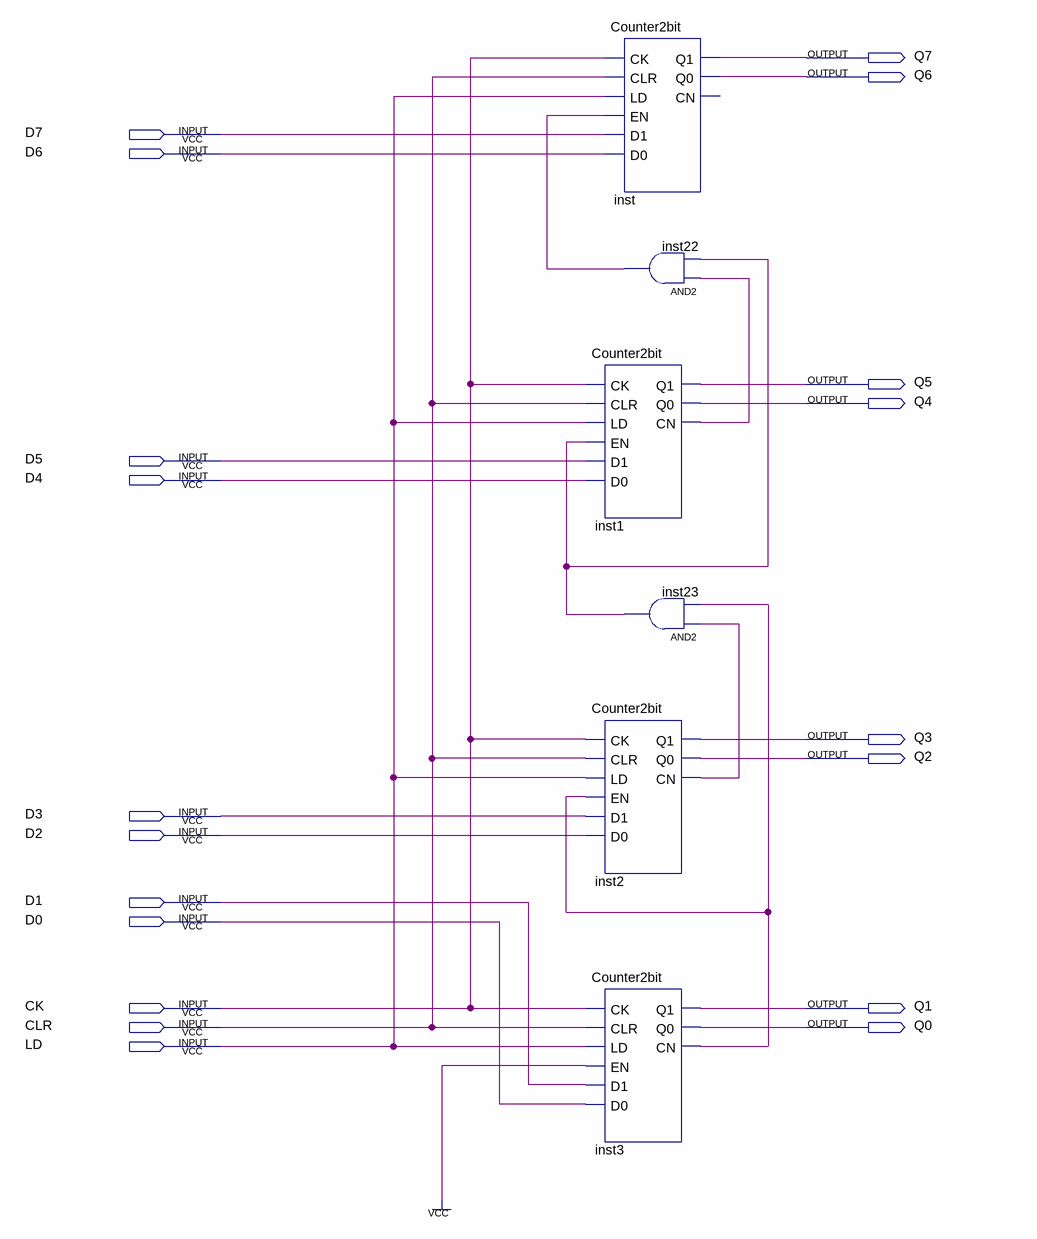
[diagram p0: schematic sheet]
// Quartus schematic Counter8bit.bdf as structural Verilog: 6 symbols, 19 pins
module Counter8bit (
  input  D7,
  input  D6,
  input  D5,
  input  D4,
  input  D3,
  input  D2,
  input  D1,
  input  D0,
  input  CK,
  input  CLR,
  input  LD,
  output Q7,
  output Q6,
  output Q5,
  output Q4,
  output Q3,
  output Q2,
  output Q1,
  output Q0
);

  wire inst1_cn, inst2_cn, inst3_cn, inst22_out, inst23_out;

  Counter2bit inst (.CK(CK), .CLR(CLR), .LD(LD), .EN(inst22_out), .D1(D7), .D0(D6), .Q1(Q7), .Q0(Q6));  // open: CN
  and inst22 (inst22_out, inst1_cn, inst23_out);
  Counter2bit inst1 (.CK(CK), .CLR(CLR), .LD(LD), .EN(inst23_out), .D1(D5), .D0(D4), .Q1(Q5), .Q0(Q4), .CN(inst1_cn));
  and inst23 (inst23_out, inst2_cn, inst3_cn);
  Counter2bit inst2 (.CK(CK), .CLR(CLR), .LD(LD), .EN(inst3_cn), .D1(D3), .D0(D2), .Q1(Q3), .Q0(Q2), .CN(inst2_cn));
  Counter2bit inst3 (.CK(CK), .CLR(CLR), .LD(LD), .EN(1'b1), .D1(D1), .D0(D0), .Q1(Q1), .Q0(Q0), .CN(inst3_cn));
endmodule
